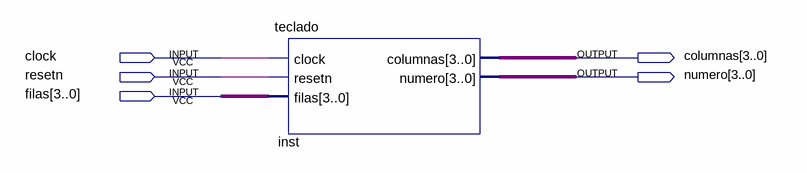
[diagram p0: schematic sheet]
// Quartus schematic prueba_teclado.bdf as structural Verilog: 1 symbols, 5 pins
module prueba_teclado (
  input  clock,
  input  resetn,
  input  [3:0] filas,
  output [3:0] columnas,
  output [3:0] numero
);

  teclado inst (.clock(clock), .resetn(resetn), .filas(filas), .columnas(columnas), .numero(numero));
endmodule
